# EAGLE schematic simblee_gate (EAGLE 7.6.0)
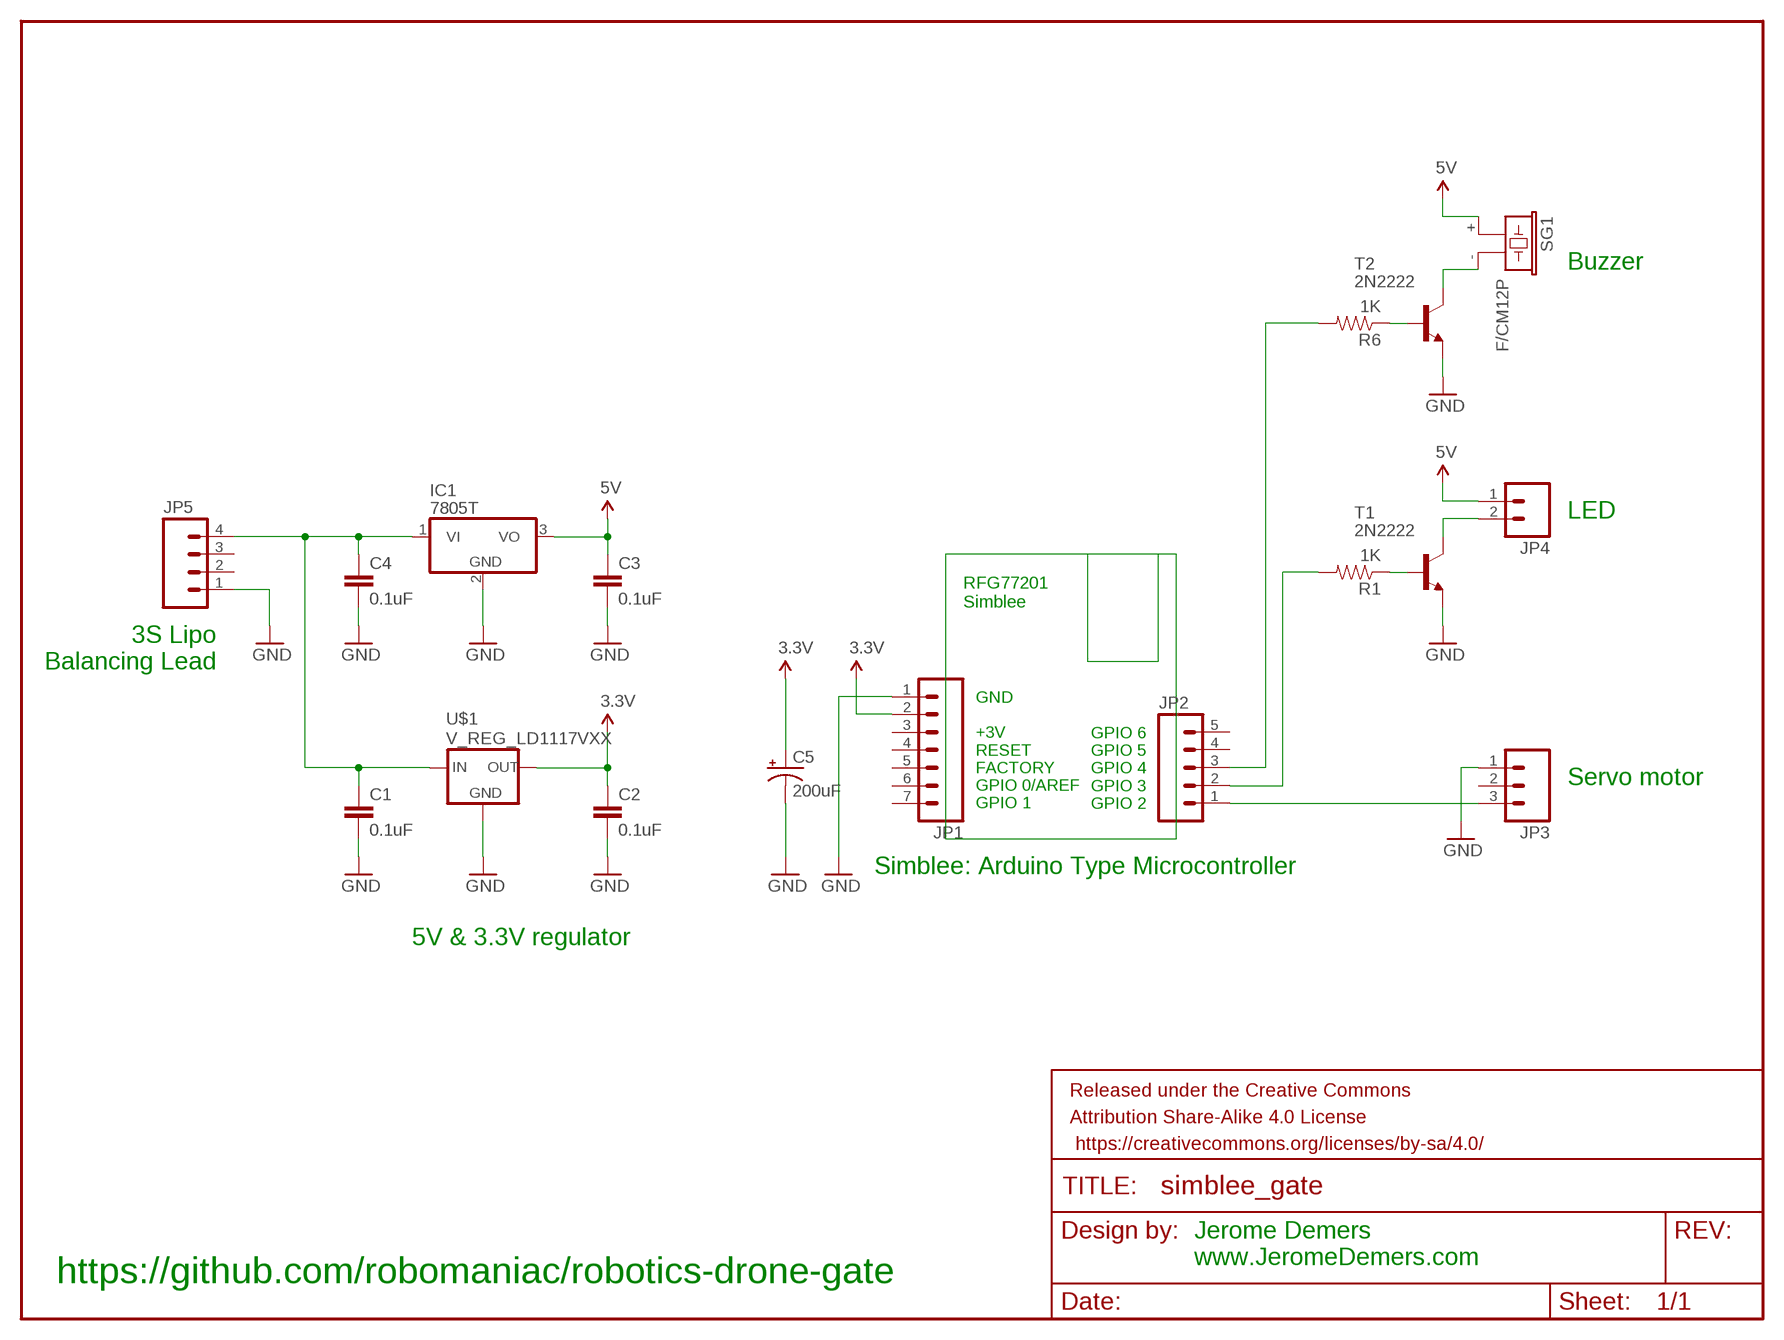
[diagram p0: schematic, sheet 1]

## Parts
C1  0.1uF  0.1UF-25V(+80/-20%)(0603)  [0603-CAP]
C2  0.1uF  0.1UF-25V(+80/-20%)(0603)  [0603-CAP]
C3  0.1uF  0.1UF-25V(+80/-20%)(0603)  [0603-CAP]
C4  0.1uF  0.1UF-25V(+80/-20%)(0603)  [0603-CAP]
C5  200uF  100UF-25V-20%(PTH)  [CPOL-RADIAL-100UF-25V]
FRAME1  FRAME-LETTER  [CREATIVE_COMMONS]
IC1  7805T  [TO220H]
JP1  M07  [1X07]
JP2  M05PTH  [1X05]
JP3  M03PTH  [1X03]
JP4  M02JST-PTH-VERT  [JST-2-PTH-VERT]
JP5  M04POLAR  [MOLEX-1X4]
R1  1K  RESISTOR0805-RES  [0805]
R6  1K  RESISTOR0805-RES  [0805]
SG1  F/CM12P  [F/CM12P]
T1  2N2222  [TO92-EBC-OVAL]
T2  2N2222  [TO92-EBC-OVAL]
U$1  V_REG_LD1117VXX  [78XXL]

## Nets
3.3V: C2.1 C5.1(+) JP1.2 U$1.GND(OUT)
GND: C1.2 C2.2 C3.2 C4.2 C5.2(-) IC1.2(GND) JP1.1 JP3.1 JP5.1 T1.E T2.E U$1.IN(GND)
N$2: JP2.1 JP3.3
N$5: R1.1 T1.B
N$6: JP4.2 T1.C
N$7: C1.1 C4.1 IC1.1(VI) JP5.4 U$1.OUT(IN)
N$8: JP2.2 R1.2
N$12: R6.1 T2.B
N$13: SG1.- T2.C
N$14: JP2.3 R6.2
VCC: C3.1 IC1.3(VO) JP4.1 SG1.+ ; supply symbol labelled 5V
Unconnected: JP1.3 JP1.4 JP1.5 JP1.6 JP1.7 JP2.4 JP2.5 JP3.2 JP5.2 JP5.3

## Notes on the sheet
- Buzzer
- LED
- RFG77201
  Simblee
- 3S Lipo
  Balancing Lead
- GND
  
  +3V
  RESET
  FACTORY
  GPIO 0/AREF
  GPIO 1
- GPIO 6
  GPIO 5
  GPIO 4
  GPIO 3
  GPIO 2
- Servo motor
- Simblee: Arduino Type Microcontroller
- 5V & 3.3V regulator
- Jerome Demers
  www.JeromeDemers.com
- https://github.com/robomaniac/robotics-drone-gate

## Library data of the parts
C1-C4 = SparkFun-Capacitors:0.1UF-25V(+80/-20%)(0603): CAP-00810 Ceramic Standard decoupling cap; PROD_ID: CAP-00810
C5 = SparkFun-Capacitors:100UF-25V-20%(PTH): CAP-08439; PROD_ID: CAP-08439
FRAME1 = SparkFun-Aesthetics:FRAME-LETTER: Schematic Frame Standard 8.5x11 US Letter frame
IC1 = linear:78*: Positive VOLTAGE REGULATOR Source: http://cache.national.com/ds/LM/LM78L05.pdf http://www.fairchildsemi.com/ds/LM/LM7805.pdf
JP1 = SparkFun-Connectors:M07: Header 7 Standard 7-pin 0.1" header. Use with straight break away headers (SKU : PRT-00116), right angle break away headers (PRT-00553), swiss pins (PRT-00743), machine pins (PRT-00117), and female headers (PRT-00115). NOTES ON THE VARIANTS LOCK and LOCK_LONGPADS... This footprint was designed to help hold the alignment of a through-hole component (i.e. 7-pin header) while soldering it into place. You may notice that each hole has been shifted either up or down by 0.005 of an inch from it's more standard position (which is usually a perfectly straight line). This slight alteration caused the pins (the squares in the middle) to touch the edges of the holes. Because they are alternating, it causes a "brace" to hold the header in place. 0.005 has proven to be the perfect amount of "off-center" position when using our standard breakaway headers. Although looks a little odd when you look at the bare footprint, once you have a header in there, the alteration is very hard to notice. Also, if you push a header all the way into place, it is covered up entirely on the bottom side. This idea of altering the position of holes to aid alignment will be further integrated into the Sparkfun Library for other footprints. It can help hold any component with 3 or more connection pins.
JP2 = SparkFun-Connectors:M05: Header 5 Standard 5-pin 0.1" header. Use with straight break away headers (SKU : PRT-00116), right angle break away headers (PRT-00553), swiss pins (PRT-00743), machine pins (PRT-00117), and female headers (PRT-00115). Molex polarized connector foot print use with SKU : PRT-08230 with associated crimp pins and housings.
JP3 = SparkFun-Connectors:M03: Header 3 Standard 3-pin 0.1" header. Use with straight break away headers (SKU : PRT-00116), right angle break away headers (PRT-00553), swiss pins (PRT-00743), machine pins (PRT-00117), and female headers (PRT-00115). Molex polarized connector foot print use with SKU : PRT-08232 with associated crimp pins and housings.
JP4 = SparkFun-Connectors:M02: Standard 2-pin 0.1" header. Use with - straight break away headers ( PRT-00116) - right angle break away headers (PRT-00553) - swiss pins (PRT-00743) - machine pins (PRT-00117) - female headers (PRT-00115) Molex polarized connector foot print use with: PRT-08233 with associated crimp pins and housings. 2.54_SCREWTERM for use with PRT-10571. 3.5mm Screw Terminal footprints for PRT-08084 5mm Screw Terminal footprints for use with PRT-08432
JP5 = SparkFun-Connectors:M04: Header 4 Standard 4-pin 0.1" header. Use with straight break away headers (SKU : PRT-00116), right angle break away headers (PRT-00553), swiss pins (PRT-00743), machine pins (PRT-00117), and female headers (PRT-00115). Molex polarized connector foot print use with SKU : PRT-08231 with associated crimp pins and housings. 1MM SMD Version SKU: PRT-10208
R1 R6 = SparkFun-Resistors:RESISTOR: Resistor Basic schematic elements and footprints for 0603, 1206, and PTH resistors.
SG1 = buzzer:F/CM12P: BUZZER Source: Buerklin; OC_FARNELL: unknown; OC_NEWARK: unknown
T1 T2 = adafruit:2N2222: NPN TRANSISTOR Big oval pads
U$1 = SparkFun-PowerIC:V_REG_LD1117VXX: LD1117VXX voltage regulator. We carry the 3.3V version (COM-00526) in TO-220 package.